# EAGLE schematic servos_schematic (EAGLE 6.4)
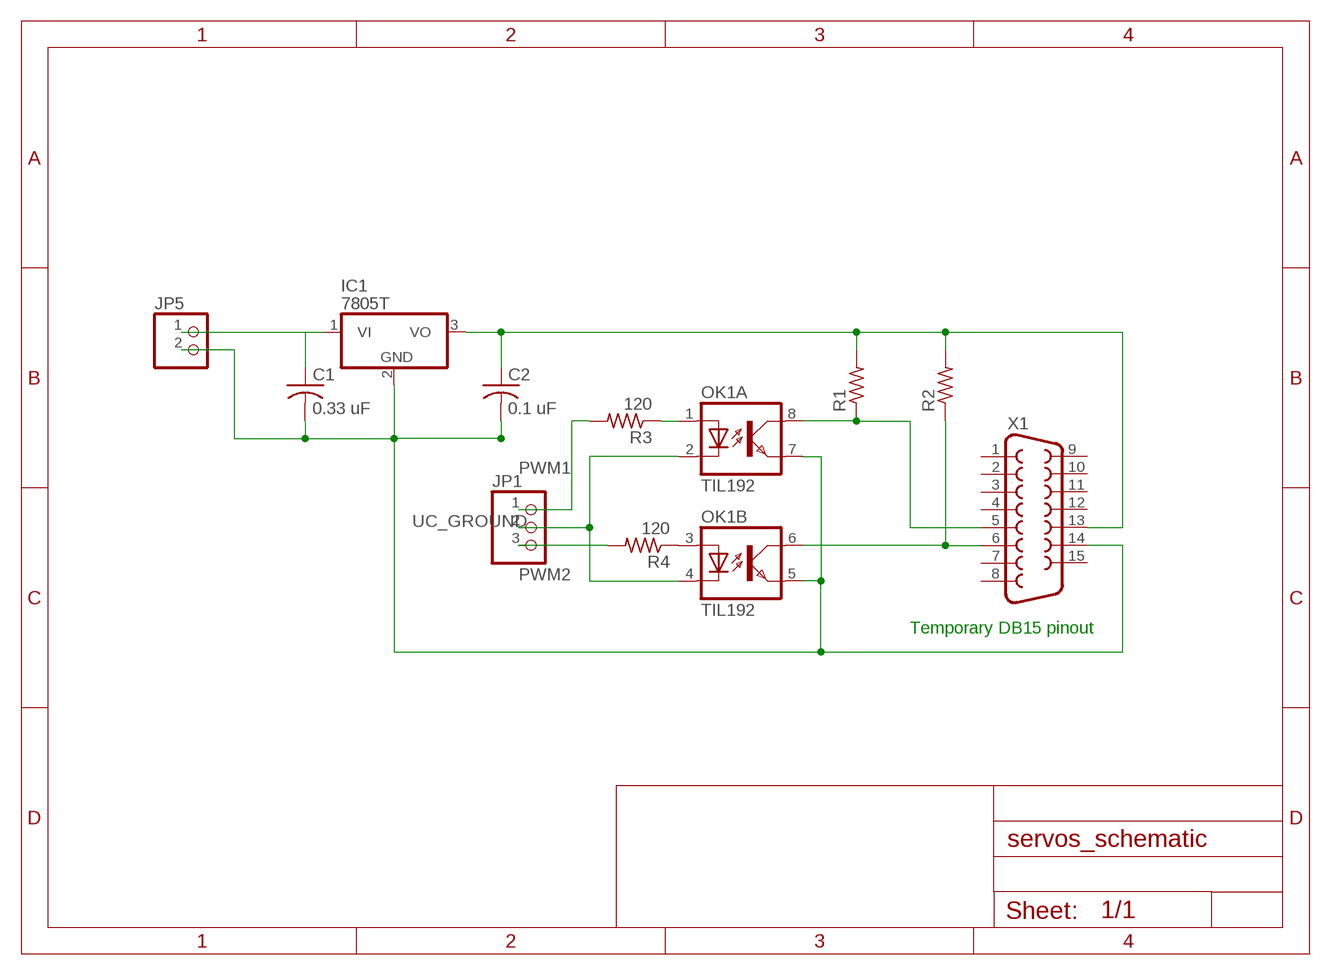
[diagram p0: schematic, sheet 1]

## Parts
C1  0.33 uF  C-US025-050X050  [C025-050X050]
C2  0.1 uF  C-US025-050X050  [C025-050X050]
IC1  7805T  [TO220H]
JP1  PINHD-1X3  [1X03]
JP5  PINHD-1X2  [1X02]
OK1  TIL192  [DIL08]
R1  R-US_0204/5  [0204/5]
R2  R-US_0204/5  [0204/5]
R3  120  R-US_0204/5  [0204/5]
R4  120  R-US_0204/5  [0204/5]
X1  F15H  [F15H]

## Nets
5V: C2.1 IC1.3(VO) R1.2 R2.2 X1.13
GROUND: C1.2 C2.2 IC1.2(GND) JP5.2 OK1.5(B:EMIT) OK1.7(A:EMIT) X1.14
N$1: OK1.1(A:A) R3.1
N$2: OK1.3(B:A) R4.1
N$6: OK1.8(A:COL) R1.1 X1.5
N$7: OK1.6(B:COL) R2.1 X1.6
N$19: C1.1 IC1.1(VI) JP5.1
PWM1: JP1.1 R3.2
PWM2: JP1.3 R4.2
UC_GROUND: JP1.2 OK1.2(A:C) OK1.4(B:C)
Unconnected: X1.1 X1.2 X1.3 X1.4 X1.7 X1.8 X1.9 X1.10 X1.11 X1.12 X1.15

## Notes on the sheet
- Temporary DB15 pinout

## Library data of the parts
C1 C2 = adafruit:C-US: CAPACITOR, American symbol
IC1 = adafruit:78*: Positive VOLTAGE REGULATOR Added bigger pads to the TO-92 package
JP1 = adafruit:PINHD-1X3: PIN HEADER
JP5 = pinhead:PINHD-1X2: PIN HEADER
OK1 = optocoupler:TIL192: TEXAS INSTRUMENTS OPTO COUPLER; OC_FARNELL: 1683364; OC_NEWARK: unknown
R1-R4 = resistor:R-US_: RESISTOR, American symbol
X1 = adafruit:F15: SUB-D HDH is also known as a 'right angle VGA' connector